# Altium schematic sheet CAN.SchDoc
size A
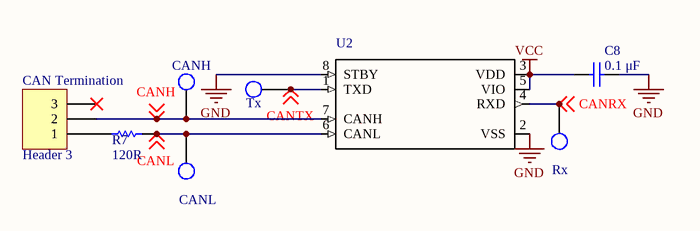
[diagram p0: CAN.SchDoc]

## Parts
C8  0.1 μF  [Cap 0805]
CAN_Termination  Header 3  [HDR1X3]
CANH  Test Point  [Test Point pad]  (value not drawn)
CANL  Test Point  [Test Point pad]  (value not drawn)
R7  120R  [RESC0805(2012)_N]
Rx  Test Point  [Test Point Through-hole]  (value not drawn)
Tx  Test Point  [Test Point Through-hole]  (value not drawn)
U2  MCP2562-E/SN  [SOIC127P600X175-8N]  (value not drawn)

## Nets
GND: C8.2 U2.2(VSS) U2.8(STBY)
VCC: C8.1 U2.3(VDD) U2.5(VIO)
CANH: CAN_Termination.2 CANH.1 U2.7(CANH) ; off-sheet CANH
CANL: CANL.1 R7.1 U2.6(CANL) ; off-sheet CANL
CANRX: Rx.1 U2.4(RXD) ; off-sheet CANRX
CANTX: Tx.1 U2.1(TXD) ; off-sheet CANTX
NetCAN_Termination_1: CAN_Termination.1 R7.2

Not connected (* = marked no-connect by the designer): CAN_Termination 3*

## Notes on the sheet
- Title
- Size:
- Date:
- A
- Number:
- Time:
- Revision:
- Sheet
- of
- File:

## Library data of the parts
C8 = Capacitor 0805: Standard Capacitor; Mounting Technology: SurfaceMount; Case Size/Dimension: 0805; Package Reference: 0805; Capacitance: 0.1 μF
CAN_Termination = Header 3: Header, 3-Pin; LatestRevisionDate: 17-Jul-2002; LatestRevisionNote: Re-released for DXP Platform.; Publisher: Altium Limited
R7 = Resistor 0805: Generic 0805 Resistor; Tolerance: 5 %; Case-Metric: 2012; Case-EIA: 0805; Power: 0.125 W; Technology: SMT; Value: 120R
U2 = CAN Tranceiver: Microchip MCP2562-E/SN, CAN Transceiver 1MBps 1-channel IEC 61000-4-2, 8-Pin SOIC; Price: None; MF: Microchip; SnapEDA_Link: https://www.snapeda.com/parts/MCP2562-E/SN/Microchip/view-part/?ref=snap; MP: MCP2562-E/SN; Availability: Unavailable; Package: SO-8 Microchip; Value: *